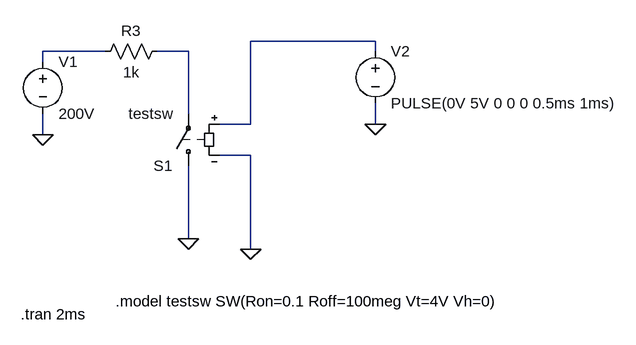
[diagram p0: schematic voltage controlled switch test 2.asc]
voltage controlled switch test 2.asc, the LTspice schematic file:
Version 4
SHEET 1 880 680
WIRE 416 48 224 48
WIRE 0 64 -96 64
WIRE 128 64 80 64
WIRE 416 64 416 48
WIRE -96 80 -96 64
WIRE 128 160 128 64
WIRE 224 176 224 48
WIRE 224 176 176 176
WIRE 416 176 416 144
WIRE -96 192 -96 160
WIRE 224 224 176 224
WIRE 128 352 128 240
WIRE 224 368 224 224
FLAG 224 368 0
FLAG 128 352 0
FLAG -96 192 0
FLAG 416 176 0
SYMBOL sw 128 256 R180
SYMATTR InstName S1
SYMATTR Value testsw
SYMBOL res 96 48 R90
WINDOW 0 0 56 VBottom 2
WINDOW 3 32 56 VTop 2
SYMATTR InstName R3
SYMATTR Value 1k
SYMBOL voltage -96 64 R0
WINDOW 123 0 0 Left 0
WINDOW 39 0 0 Left 0
SYMATTR InstName V1
SYMATTR Value 200V
SYMBOL voltage 416 48 R0
WINDOW 123 0 0 Left 0
WINDOW 39 0 0 Left 0
SYMATTR InstName V2
SYMATTR Value PULSE(0V 5V 0 0 0 0.5ms 1ms)
TEXT 16 448 Left 2 !.model testsw SW(Ron=0.1 Roff=100meg Vt=4V Vh=0)
TEXT -130 468 Left 2 !.tran 2ms

The netlist it stands for:
* voltage controlled switch test 2.asc
S1 0 N003 N001 0 testsw
R3 N003 N002 1k
V1 N002 0 200V
V2 N001 0 PULSE(0V 5V 0 0 0 0.5ms 1ms)
.model testsw SW(Ron=0.1 Roff=100meg Vt=4V Vh=0)
.tran 2ms
.backanno
.end